# Altium schematic sheet FrontalKeyboardRGB - SCH.SchDoc
size A3; SheetNumber: 2; SheetTotal: 9
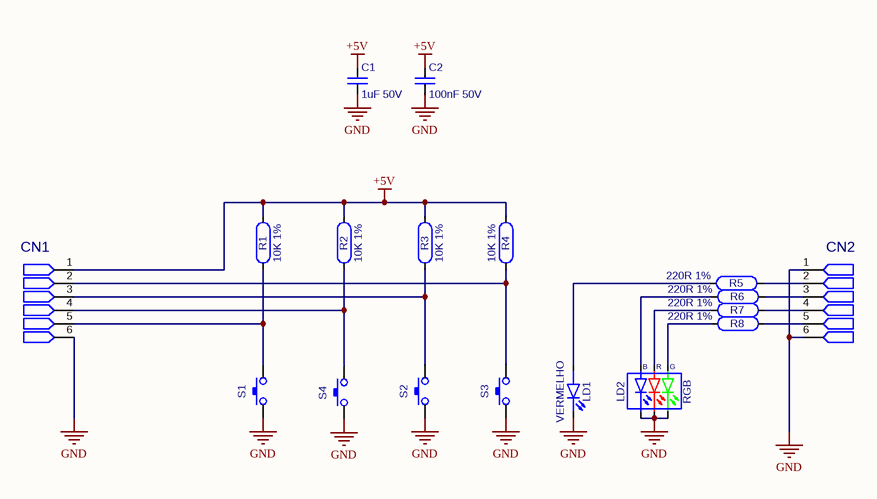
[diagram p0: FrontalKeyboardRGB - SCH.SchDoc]

## Parts
C1  1uF 50V  [C0805]
C2  100nF 50V  [C0805]
CN1  CON BARRA 1x6 180 MACHO PTH  [BARRA6PM180]  (value not drawn)
CN2  CON BARRA 1x6 180 MACHO PTH  [BARRA6PM180]  (value not drawn)
LD1  VERMELHO  [LED3528-RED]
LD2  RGB  [LED-RGB-HL-AF-5060H248BS36FU76GC-S1-T1]
R1  10K 1%  [R0805]
R2  10K 1%  [R0805]
R3  10K 1%  [R0805]
R4  10K 1%  [R0805]
R5  220R 1%  [R0805]
R6  220R 1%  [R0805]
R7  220R 1%  [R0805]
R8  220R 1%  [R0805]
S1  TECLA SMD 4,3mm  [TECLA_TS-06M-ASM]  (value not drawn)
S2  TECLA SMD 4,3mm  [TECLA_TS-06M-ASM]  (value not drawn)
S3  TECLA SMD 4,3mm  [TECLA_TS-06M-ASM]  (value not drawn)
S4  TECLA SMD 4,3mm  [TECLA_TS-06M-ASM]  (value not drawn)

## Nets
+5V: C1.1 C2.1 CN1.1 R1.1 R2.1 R3.1 R4.2
GND: C1.2 C2.2 CN1.6 CN2.1 CN2.6 LD1.2(cathode) LD2.4(cathode) LD2.5(cathode) LD2.6(cathode) S1.2 S2.2 S3.2 S4.2
NetCN1_2: CN1.2 R4.1 S3.1
NetCN1_3: CN1.3 R3.2 S2.1
NetCN1_4: CN1.4 R2.2 S4.1
NetCN1_5: CN1.5 R1.2 S1.1
NetCN2_2: CN2.2 R5.2
NetCN2_3: CN2.3 R6.2
NetCN2_4: CN2.4 R7.2
NetCN2_5: CN2.5 R8.2
NetLD1_1: LD1.1(anode) R5.1
NetLD2_1: LD2.1(anode) R8.1
NetLD2_2: LD2.2(anode) R7.1
NetLD2_3: LD2.3(anode) R6.1

## Notes on the sheet
- Aplicação:
- Cod. SC:
- PCI:
- Documento: EE-
- Rev. PCI:
- Rev.EE:
- Data:
- Cod. PCI:
- Projetista:
- Aprovado por:
- Pg:
- /
- (in symbol LED RGB 5060) B; R; G

## Library data of the parts
C1 = CC 1uF 50V 0805: REFERENCIA: 003.05.015; ENCAPSULAMENTO: C0805; ModifyDate: 01/08/2016 08:47:26; Value: 1uF 50V
C2 = CC 100nF 50V 0805: REFERENCIA: 003.05.002; ENCAPSULAMENTO: C0805; ModifyDate: 05/27/2015 14:07:26; Value: 100nF 50V
CN1 CN2 = CON BARRA 1x6 180 MACHO PTH: Barra de pinos simples 1x6 180g. 2,54mm; Part Number: {Part Number}; Value: BARRA6PM180; REFERENCIA: 052.01.014; ENCAPSULAMENTO: PTH; ModifyDate: 05/27/2015 14:07:26
LD1 = LED VM 3528: LED SMT 3528; ENCAPSULAMENTO: LD3528; Part Number: *; REFERENCIA: 006.00.018; ModifyDate: 05/27/2015 14:07:26; Value: VERMELHO
LD2 = LED RGB 5060: LED SMT 5060; Part Number: HL-AF-5060H248BS36FU76GC-S1-T1; ENCAPSULAMENTO: LD5060; REFERENCIA: 006.00.021; ModifyDate: 03/08/2016 17:00:26; Value: RGB
R1-R4 = RES 10K 1% 0805: Part Number: {Part Number}; REFERENCIA: 002.05.004; ENCAPSULAMENTO: R0805; ModifyDate: 05/27/2015 14:07:26; Value: 10K 1%
R5-R8 = RES 220R 1% 0805: Part Number: {Part Number}; REFERENCIA: 002.05.014; ENCAPSULAMENTO: R0805; ModifyDate: 10/08/2016 08:22:26; Value: 220R 1%
S1-S4 = TEC TACTIL 4,3MM SMD: TECLA TACTIL 4,3MM SMD; Value: TECLA SMD 4,3mm; REFERENCIA: 051.00.003; ENCAPSULAMENTO: SMD; ModifyDate: 05/27/2015 14:07:26